# EAGLE design HL_sensors_pcb_all (EAGLE 9.5.2)

## Sheet 1 of 2
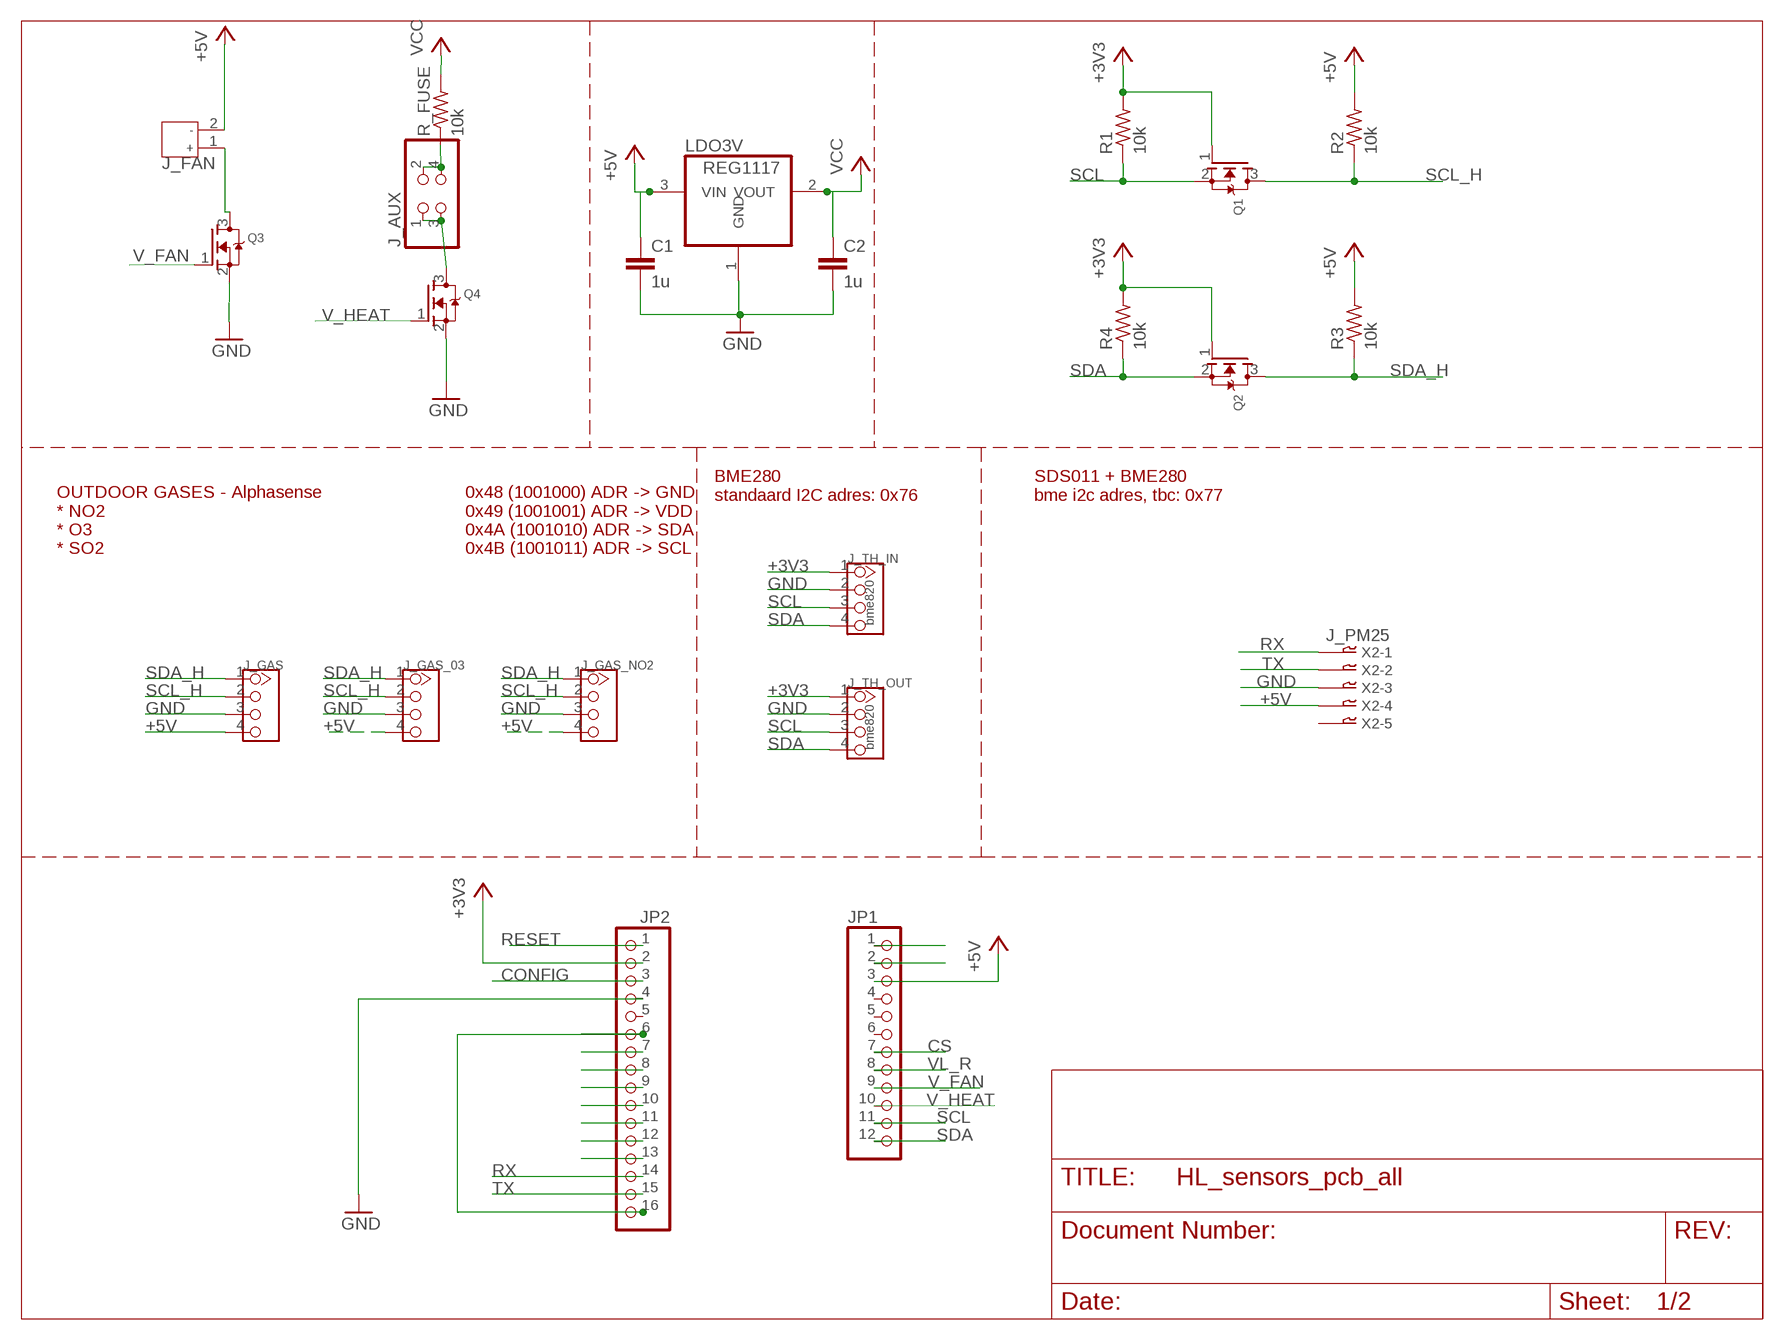
[diagram p0: schematic, sheet 1]

### Parts
C1  1u  C-EUC1206K  [C1206K]
C2  1u  C-EUC1206K  [C1206K]
J_AUX  PINHD-2X2  [2X02]
J_FAN  JACK-JST-2P-PW'2.0'  [JST-2.0]
J_GAS  TWIG-4P-2.0-2.0  [4P-2.0]
J_GAS_03  TWIG-4P-2.0-2.0  [4P-2.0]
J_GAS_NO2  TWIG-4P-2.0-2.0  [4P-2.0]
J_TH_IN  bme820  TWIG-4P-2.0-2.0  [4P-2.0]
J_TH_OUT  bme820  TWIG-4P-2.0-2.0  [4P-2.0]
JP1  HEADER-1X12OVAL  [1X12_OVAL]
JP2  HEADER-1X16  [1X16_OVAL]
LDO3V  REG1117  [SOT223]
Q1  MOSFET-NWIDE  [SOT23-WIDE]
Q2  MOSFET-NWIDE  [SOT23-WIDE]
Q3  MOSFET-NWIDE  [SOT23-WIDE]
Q4  MOSFET-NWIDE  [SOT23-WIDE]
R1  10k  RESISTOR1206  [1206]
R2  10k  RESISTOR1206  [1206]
R3  10k  RESISTOR1206  [1206]
R4  10k  RESISTOR1206  [1206]
R_FUSE  10k  RESISTOR1206  [1206]
X2  J_PM25  05-JST-B5B-XH-A  [B5B-XH]

### Nets
+3V3 [power]: J_TH_IN.1 J_TH_OUT.1 JP2.2 Q1.1(G) Q2.1(G) R1.2 R4.2
+5V [power_5V]: C1.1 J_FAN.2 J_GAS.4 J_GAS_03.4 J_GAS_NO2.4 JP1.3 LDO3V.3(VIN) R2.2 R3.2 X2.P$4
CONFIG: JP2.3
CS: JP1.7
GND [power]: C1.2 C2.2 J_GAS.3 J_GAS_03.3 J_GAS_NO2.3 J_TH_IN.2 J_TH_OUT.2 JP2.4 LDO3V.1(GND) Q3.2(S) Q4.2(S) X2.P$3
N$1: JP1.1
N$2: JP1.2
N$3: J_FAN.1 Q3.3(D)
N$4: J_AUX.1 J_AUX.3 Q4.3(D)
N$6: J_AUX.2 J_AUX.4 R_FUSE.1
N$14: JP2.7
N$17: JP2.8
N$18: JP2.9
N$19: JP2.10
N$20: JP2.11
N$21: JP2.12
N$22: JP2.13
N$23: JP2.6 JP2.16
RESET: JP2.1
RX: JP2.14 X2.P$1
SCL: J_TH_IN.3 J_TH_OUT.3 JP1.11 Q1.2(S) R1.1
SCL_H: J_GAS.2 J_GAS_03.2 J_GAS_NO2.2 Q1.3(D) R2.1
SDA: J_TH_IN.4 J_TH_OUT.4 JP1.12 Q2.2(S) R4.1
SDA_H: J_GAS.1 J_GAS_03.1 J_GAS_NO2.1 Q2.3(D) R3.1
TX: JP2.15 X2.P$2
V_FAN: JP1.9 Q3.1(G)
V_HEAT: JP1.10 Q4.1(G)
VCC [power_5V]: C2.1 LDO3V.2(VOUT) R_FUSE.2
VL_R: JP1.8
Unconnected: JP1.4 JP1.5 JP1.6 JP2.5 X2.P$5

### Notes on the sheet
- BME280
  standaard I2C adres: 0x76
- SDS011 + BME280
  bme i2c adres, tbc: 0x77
- OUTDOOR GASES - Alphasense
  * NO2
  * O3
  * SO2
- 0x48 (1001000) ADR -> GND
  0x49 (1001001) ADR -> VDD
  0x4A (1001010) ADR -> SDA
  0x4B (1001011) ADR -> SCL

## Sheet 2 of 2

## Library data of the parts
C1 C2 = resistor:C-EU: CAPACITOR, European symbol
J_AUX = pinhead:PINHD-2X2: PIN HEADER
J_FAN = Connector:JACK-JST-2P-PW
J_GAS J_GAS_03 J_GAS_NO2 J_TH_IN J_TH_OUT = Connector:TWIG-4P-2.0
JP1 = headers:HEADER-1X12
JP2 = headers:HEADER-1X16: PIN HEADER
LDO3V = burr-brown:REG1117: 800mA and 1A Low Dropout (LDO) Positive Regulator 1.8V, 2.5V, 2.85V, 3.3V, 5V, and Adj; MPN: REG1117; OC_FARNELL: 1097566; OC_NEWARK: 14P6981
Q1-Q4 = microbuilder:MOSFET-N: N-Channel Mosfet LEGEND VDS: Voltage Drain-Source ID: Drain Current RDS(ON): Drain-Source On-State Resistance VGS(TH): Gate-Source Threshold Voltage CISS: Drain-Source Input Capacitance SOT-23 Name VDS ID RDS(ON) VGS(TH) CISS Order Number 2N7002E 60V 260mA 2.5 Ohm 2.5V @ 250uA 26.7pF @ 25V 2N7002ET1GOSTR-ND BSH103 30V 850mA 400 mOhm 400mV @ 1mA 83pF @ 24V BSH103,235-ND BSS138 60V 320mA 1.6 Ohm 1.5V @ 250uA 50pF @ 10V Mouser: 771-BSS138PW115 DMN2075U-7 20V 4.2A 38 mOhm 1V @ 250 uA 594.3pF @ 10V DMN2075U-7DICT-ND * BSS138 good choice for I2C level-shifting
R1-R4 R_FUSE = ng:RESISTOR
X2 = bt_con-jst-xh:05-JST: JST CONNECTOR

## Net classes
0 default: width 0.3 mm, clearance 0.4 mm
1 power: width 0.3 mm, clearance 0.4 mm
2 power_5V: width 1 mm

## Board
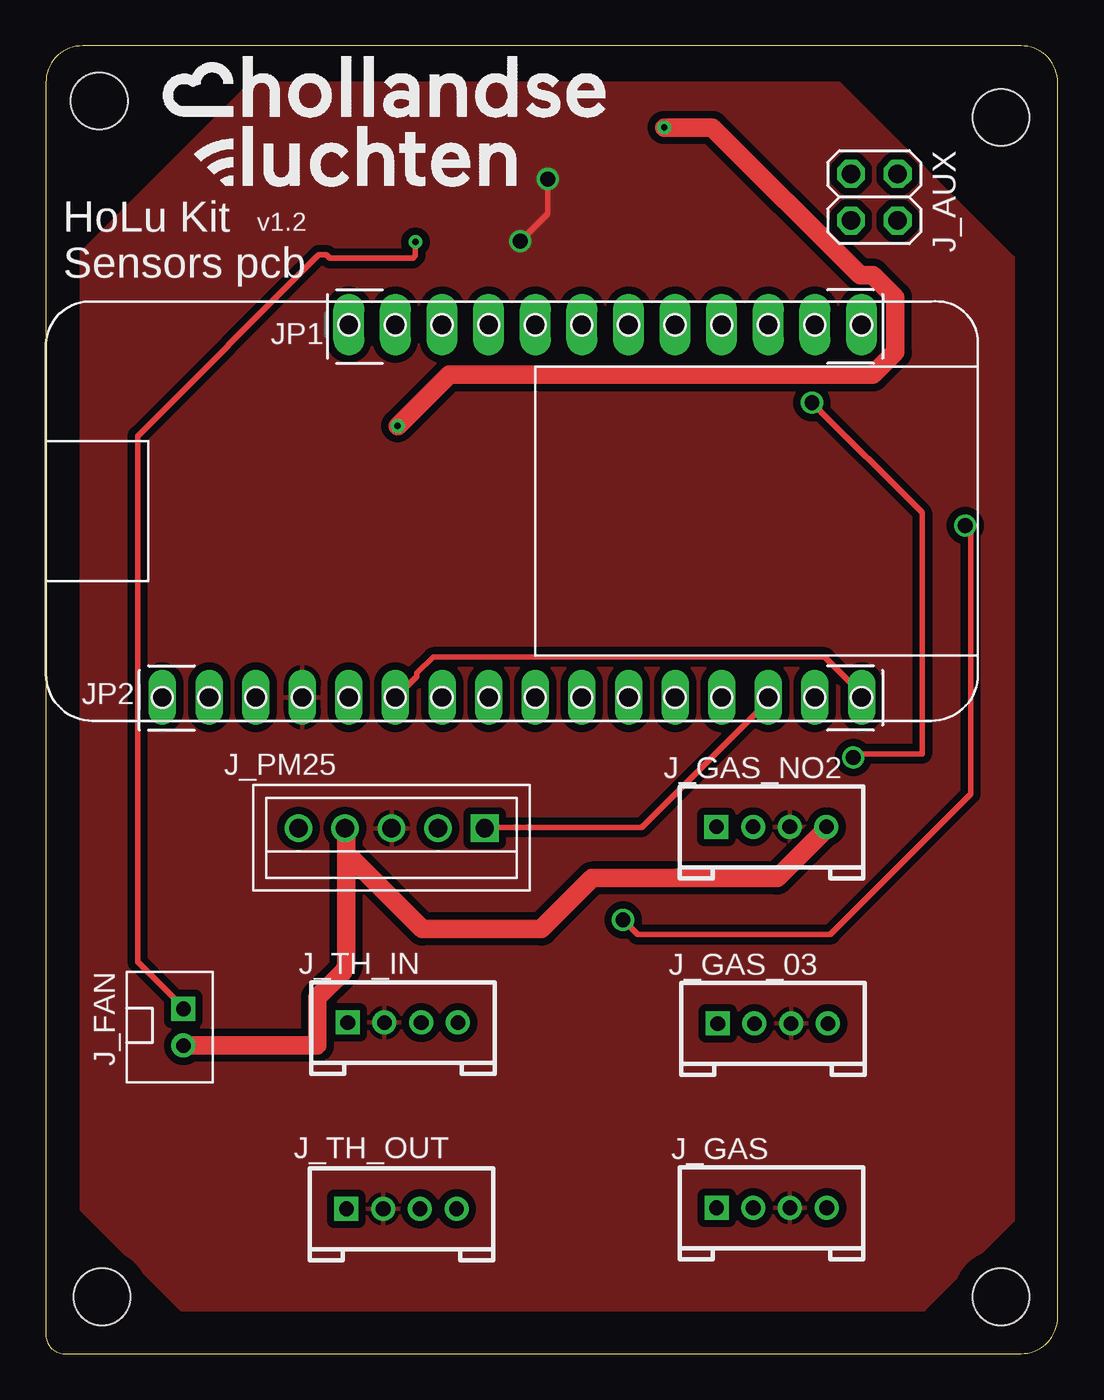
[diagram p1: board, top side]
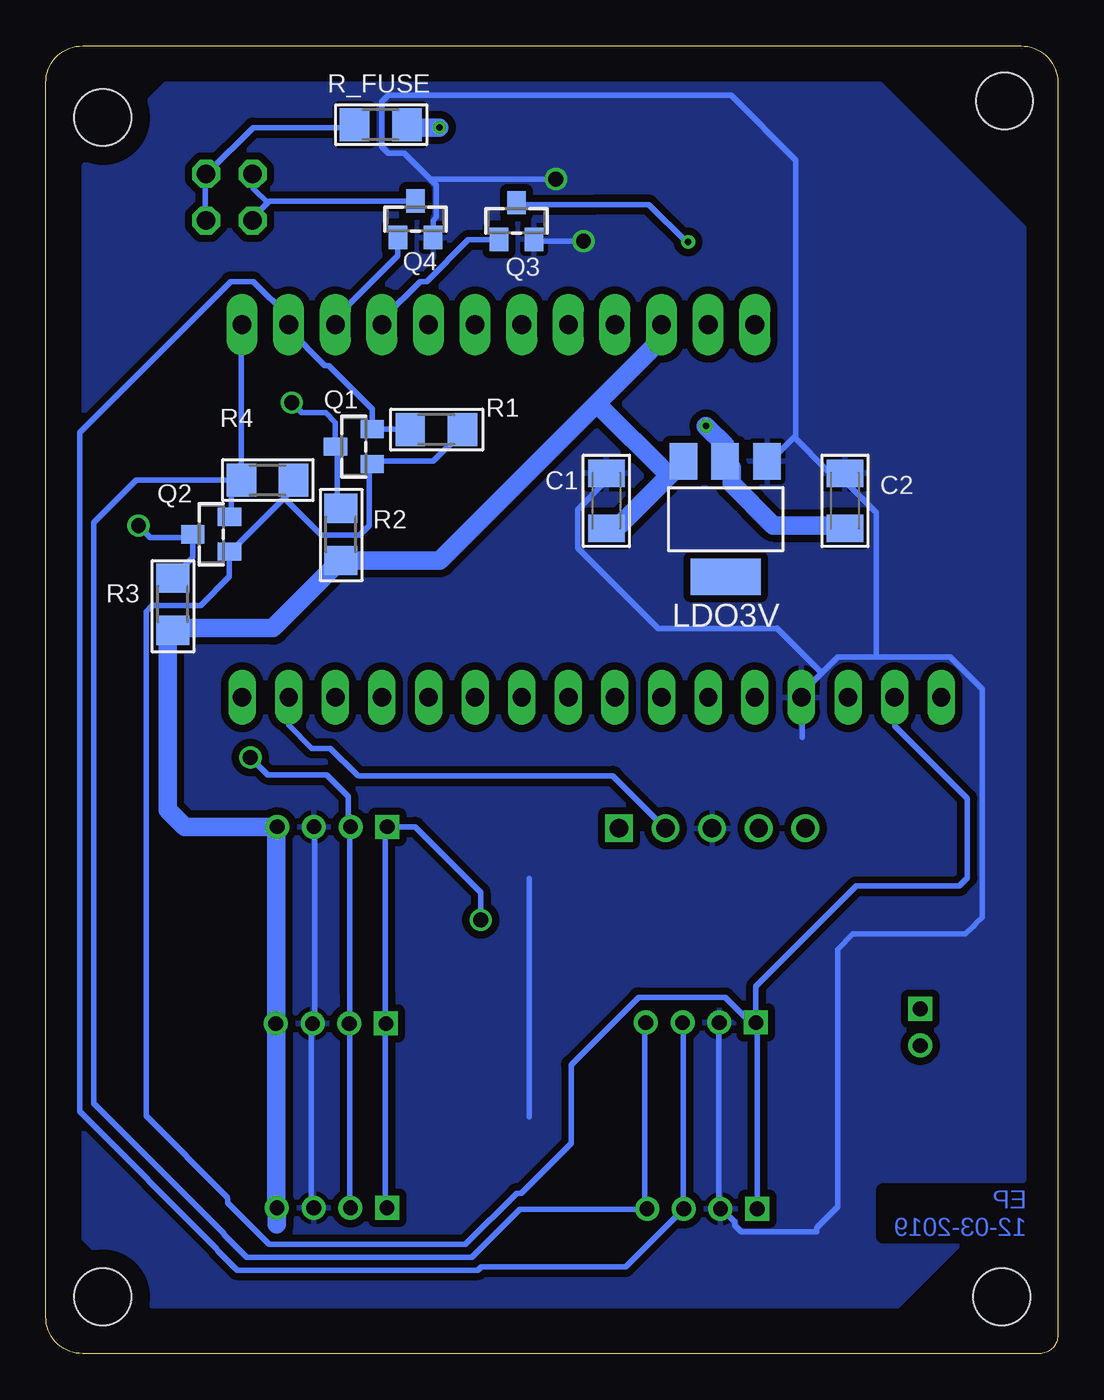
[diagram p2: board, bottom side, seen from below]

Size 55.15 x 71.3 mm. Coordinates in mm from the lower left corner, seen from the top.
Outline: 0,38.95 0,1 arc90 1,0 7.55,0 53.15,0 arc90 55.15,2 55.15,3.55 55.15,69.3 arc90 53.15,71.3 52.5,71.3 2,71.3 arc90 0,69.3 0,38.95
Copper layers (1*16): Top 0.035mm / dielectric 1.5mm / Bottom 0.035mm
Design rules "default *": minimum track width 6mil, minimum drill 0.35mm, track to track 0.4mm, track to pad 0.4mm, pad to pad 0.4mm, via to via 0.4mm, smd to smd 0.4mm, copper to edge 40mil, drill to drill 6mil, minimum pad ring 10mil, minimum via ring 8mil, stop-mask expansion 4mil, vias tented up to drill 0mil, thermal gap 10mil
Holes 3.1 mm at 52.05,3.1 3.05,3.1 2.9,68.3 52.05,67.4
Milling: 1 lines

### Footprints (pad centres in the part's own frame; a part is rotated, then mirrored left to right if it is on the bottom)
C1206K = smd 1.5 x 2: 1 -1.5,0; 2 1.5,0
2X02 = drill 1.016 octagon: 1 -1.27,-1.27; 2 -1.27,1.27; 3 1.27,-1.27; 4 1.27,1.27
JST-2.0 = drill 0.8 pad 1.3 square: 1 -1,0.75 | drill 0.8 pad 1.3: 2 1,0.75
4P-2.0 = drill 0.8 pad 1.27 square: 1 -3,0 | drill 0.8 pad 1.27: 2 -1,0; 3 1,0; 4 3,0
1X12_OVAL = drill 1.016 pad 1.676 long: 1 -13.97,0; 2 -11.43,0; 3 -8.89,0; 4 -6.35,0; 5 -3.81,0; 6 -1.27,0; 7 1.27,0; 8 3.81,0; 9 6.35,0; 10 8.89,0; 11 11.43,0; 12 13.97,0
1X16_OVAL = drill 1 long: 1 -19.05,0; 2 -16.51,0; 3 -13.97,0; 4 -11.43,0; 5 -8.89,0; 6 -6.35,0; 7 -3.81,0; 8 -1.27,0; 9 1.27,0; 10 3.81,0; 11 6.35,0; 12 8.89,0; 13 11.43,0; 14 13.97,0; 15 16.51,0; 16 19.05,0
SOT223 = smd 1.499 x 2.007: 1 -2.261,-3.15; 2 0.025,-3.15; 3 2.311,-3.15 | smd 3.81 x 2.007: 4 0,3.15
SOT23-WIDE = smd 1 x 1.27: 1 -0.95,-1; 2 0.95,-1; 3 0,1
1206 = smd 1.6 x 1.803: 1 -1.422,0; 2 1.422,0
B5B-XH = drill 1 square: P$1 -5.08,0 | drill 1: P$2 -2.54,0; P$3 0,0; P$4 2.54,0; P$5 5.08,0

### Placement (x,y rotation side)
C1  24.6,46.5 90 bottom
C2  11.6,46.5 90 bottom
J_AUX  45.15,63.05 270 top
J_FAN  6.75,17.8 270 top
J_GAS  39.55,7.95 0 top
J_GAS_03  39.62,18 0 top
J_GAS_NO2  39.54,28.72 0 top
J_TH_IN  19.45,18.05 0 top
J_TH_OUT  19.38,7.9 0 top
JP1  30.48,56.1 0 top
JP2  25.4,35.78 0 top
LDO3V  18.1,45.5 180 bottom
Q1  38.37,49.45 90 bottom
Q2  46.14,44.68 90 bottom
Q3  29.5,61.75 0 bottom
Q4  35,61.85 0 bottom
R1  33.87,50.38 0 bottom
R2  39.08,44.66 270 bottom
R3  48.24,40.87 270 bottom
R4  43.07,47.62 0 bottom
R_FUSE  36.9,67 0 bottom
U$1  [ADA_FEATHER_NOPADS]  0,34.5 0 top
X2  18.84,28.65 180 top

### Tracks (layer width: path | path; a pad name or v marks a point on that pad's centre or on a via)
+3V3
  Bottom 0.3: R1.2 32.45,50.23 34.03,48.65 37.35,48.65 Q1.1 37.53,48.48 37.53,45.15 38.05,44.63 40.15,44.63 42.17,46.64 | 42.17,46.64 41.73,47.08 41.73,47.6 R4.2 | 42.17,46.64 45.05,43.75 Q2.1 45.14,42.37 46.72,40.8 49.37,40.8 49.69,40.47 49.69,12.96 45.26,8.53 45.25,8.4 45.25,8.22 42.98,5.95 32.3,5.95 29.5,8.75 29.25,8.75 26.53,11.47 26.53,15.75 22.85,19.43 18.12,19.43 16.9,18.2 16.55,18.2 J_TH_IN.1 | JP2.2 8.89,34.23 4.92,30.26 4.92,25.94 5.37,25.5 10.98,25.5 16.45,20.02 J_TH_IN.1 | J_TH_OUT.1 16.38,8.05 16.38,18.02 J_TH_IN.1
+5V
  Top 1: 16.38,26.95 16.38,21.18 16.2,20.82 14.8,19.43 14.8,16.8 14.45,16.8 7.62,16.8 J_FAN.2 | 16.38,26.95 16.38,28.52 X2.P$4 | 16.38,26.95 16.73,26.95 20.53,23.15 27,23.15 29.78,25.93 39.85,25.93 42.58,28.66 J_GAS_NO2.4
  Bottom 1: 48.2,39.55 48.5,39.55 48.5,29.65 47.57,28.72 J_GAS_NO2.4 42.6,28.6 42.6,18.35 J_GAS_03.4 42.6,18 42.6,7.95 J_GAS.4 42.55,7.05 | 48.2,39.55 R3.2 | 25.12,51.79 33.68,43.23 38.58,43.23 R2.2 39.1,43.23 42.78,39.55 48.2,39.55 | 25.12,51.79 21.6,55.3 21.6,56 JP1.3 21.45,56.52 21.45,57.05 | 21.19,47.86 20.58,48.48 LDO3V.3 | 21.19,47.86 23.9,45.15 24.6,45.15 C1.1 | 21.19,47.86 25.12,51.79 | 16.38,28.52 X2.P$4
GND  (via drill 0.81)
  Top 0.3: v27.36,64.04 27.36,62.16 v25.85,60.65
  Bottom 0.3: J_GAS_NO2.3 40.5,28.6 40.5,18 J_GAS_03.3 40.68,18 40.68,7.95 J_GAS.3 40.5,7.95 | 28.82,12.91 28.82,25.86 28.8,25.9 | Q4.2 34.05,61.77 33.88,61.95 33.88,63.7 34.21,64.04 | 34.21,64.04 35.62,65.45 36.5,65.45 36.85,65.8 36.85,68.25 36.5,68.6 17.8,68.6 14.28,65.08 14.28,50.05 14.36,49.96 | 14.36,49.96 15.67,48.65 LDO3V.1 | 14.36,49.96 12.53,48.12 11.65,48.12 C2.2 11.47,47.95 11.47,47.42 9.9,45.85 9.9,37.98 | J_TH_IN.2 18.48,18.02 18.48,8.05 J_TH_OUT.2 18.3,7.88 17.6,7.17 17.6,7 17.25,6.65 13.15,6.65 13.15,6.85 12,8 12,22.05 11.17,22.88 5.03,22.88 4.61,23.3 4.58,23.3 4.41,23.5 4.12,23.79 4.12,36.23 5.88,37.98 9.9,37.98 | C1.2 24.6,47.6 26.18,46.02 26.18,43.92 21.78,39.52 15.32,39.52 15.32,39.55 12.88,37.1 | 9.9,37.98 12,37.98 12.88,37.1 | 12.88,37.1 13.92,36.05 JP2.4 13.94,35.74 13.94,33.69 13.92,33.6 | 34.21,64.04 v27.36,64.04 | v25.85,60.65 28.45,60.65 Q3.2
  pour Bottom: 3.6,7.75 8.75,2.6 49.35,2.6 53.05,6.3 53.05,64.75 48.6,69.2 9.7,69.2 1.85,61.35 1.85,12.35 1.85,9.5 3.55,7.8 3.55,7.75
  pour Top: 7.36,2.39 47.88,2.39 52.75,7.26 52.75,59.77 43.25,69.27 11.15,69.27 1.9,60.02 1.9,7.85
N$3  (via drill 0.35)
  Top 0.3: J_FAN.1 7.45,18.9 5,21.35 5,50.02 14.88,59.91 15.29,59.91 15.48,59.72 20.01,59.72 20.14,59.85 v20.14,60.61
  Bottom 0.3: Q3.3 29.4,62.65 25.2,62.65 22.3,62.65 20.26,60.61 v20.14,60.61
N$4
  Bottom 0.3: 43.06,62.74 43.85,61.95 J_AUX.3 | 43.06,62.74 42.98,62.83 35.1,62.83 Q4.3 | 43.06,62.74 43.85,63.52 43.85,64.22 J_AUX.1
N$6
  Bottom 0.3: R_FUSE.1 38.43,66.85 43.85,66.85 46.3,64.4 J_AUX.2 46.48,64.22 46.48,61.95 J_AUX.4
N$23
  Top 0.3: JP2.6 19.18,35.88 20.23,36.92 20.23,37.1 21.1,37.98 42.45,37.98 44.55,35.88 JP2.16
RX
  Top 0.3: JP2.14 39.48,35.7 32.48,28.7 24.08,28.7 X2.P$1
SCL
  Bottom 0.3: 37.35,50.4 35.43,50.4 R1.1 | 37.35,50.4 Q1.2 | 41.9,56.18 JP1.11 | JP1.11 41.91,55.84 39.95,53.88 39.73,53.88 37.35,51.5 37.35,50.4 | J_TH_IN.3 20.4,18.02 20.4,8.05 J_TH_OUT.3 20.4,7.88 23.55,4.72 31.43,4.72 31.6,4.55 44.73,4.55 45.77,5.6 45.83,5.72 53.3,13.2 53.3,50.23 45.08,58.45 43.85,58.45 41.93,56.52 41.93,56.17 JP1.11
SCL_H  (via drill 0.81)
  Top 0.3: v41.75,51.85 47.75,45.85 47.75,32.7 44.2,32.7 v44,32.5
  Bottom 0.3: Q1.3 39.28,49.35 39.28,46.38 39.1,46.2 R2.1 | J_GAS.2 38.58,7.95 38.58,18 | 38.58,28.6 38.58,28.7 38.68,28.38 38.68,30.38 39.85,31.55 43.05,31.55 v44,32.5 | 38.58,18 J_GAS_03.2 | 39.45,49.35 Q1.3 | 38.58,28.78 J_GAS_NO2.2 38.58,28.6 | Q1.3 39.37,50.76 39.9,51.3 41.2,51.3 v41.75,51.85 | 38.58,18 38.58,18.1 38.58,19.6 38.58,28.6
SDA
  Bottom 0.3: Q2.2 45.05,45.68 45.05,47.08 44.53,47.6 R4.1 | JP1.12 44.49,56.07 R4.1 | R4.1 50.24,47.62 52.55,45.3 52.55,13.65 45.46,6.56 45.43,6.47 44.2,5.25 31.95,5.25 29.33,7.88 26,7.88 25.88,7.88 22.5,7.88 J_TH_OUT.4 22.5,8.05 22.5,18.02 J_TH_IN.4
SDA_H  (via drill 0.81)
  Top 0.3: v50.1,45.15 50.4,44.85 50.4,30.5 42.75,22.85 32.25,22.85 v31.45,23.65
  Bottom 0.3: J_GAS.1 36.65,7.95 36.65,18 | 36.65,18 J_GAS_03.1 | 47.15,44.5 47.15,43.4 48.2,42.35 R3.1 | 47.15,44.5 47.15,44.63 Q2.3 | v50.1,45.15 49.45,44.5 47.15,44.5 | 36.65,18 36.65,18.1 36.65,19.6 36.65,28.6 J_GAS_NO2.1 35.02,28.72 31.45,25.15 v31.45,23.65
TX
  Bottom 0.3: 41.9,35.7 JP2.15 41.91,34.26 40.65,33 39.65,33 38.16,31.51 38.08,31.5 24.25,31.5 21.45,28.7 X2.P$2
V_FAN
  Bottom 0.3: Q3.1 30.55,60.73 32.12,60.73 34.4,58.45 34.75,58.45 36.68,56.52 36.68,56.17 JP1.9
V_HEAT
  Bottom 0.3: Q4.1 35.98,60.73 35.98,59.85 39.3,56.52 39.3,56.17 JP1.10
VCC  (via drill 0.35)
  Top 1: v33.7,66.85 36.33,66.85 44.38,58.8 45.08,58.8 46.3,57.58 46.3,54.6 45.08,53.38 21.98,53.38 v19.18,50.58
  Bottom 0.3: LDO3V.2 18.12,49 | 35.45,66.85 R_FUSE.2 | LDO3V.2 | 11.65,45.15 C2.1 | 18.3,48.48 LDO3V.2
  Bottom 1: v33.7,66.85 35.45,66.85 R_FUSE.2 | v19.18,50.58 18.12,49.52 18.12,49 LDO3V.2 17.78,48.3 17.78,47.42 15.5,45.15 11.65,45.15 C2.1

### Text on the board
Bottom: EP / 12-03-2019
Dimension: /Users/emma/Desktop/logo-hollandse-luchten.BMP
tPlace: v1.2 | HoLu Kit / Sensors pcb
tDocu: Designed by Stichting Waag Society / / Released under the Creative Commons Attribution Share-Alike 4.0 Licence / https://creativecommons.org/licenses/by-sa/4.0/